# Altium schematic sheet DDR3.SchDoc (part 1 of 2)
size A3; Organization: ICNS, MARCS Institute; Address1: Werrington South Campus, Great Western Highway; Address2: Werrington, NSW, 2747; SheetNumber: 8; SheetTotal: 16
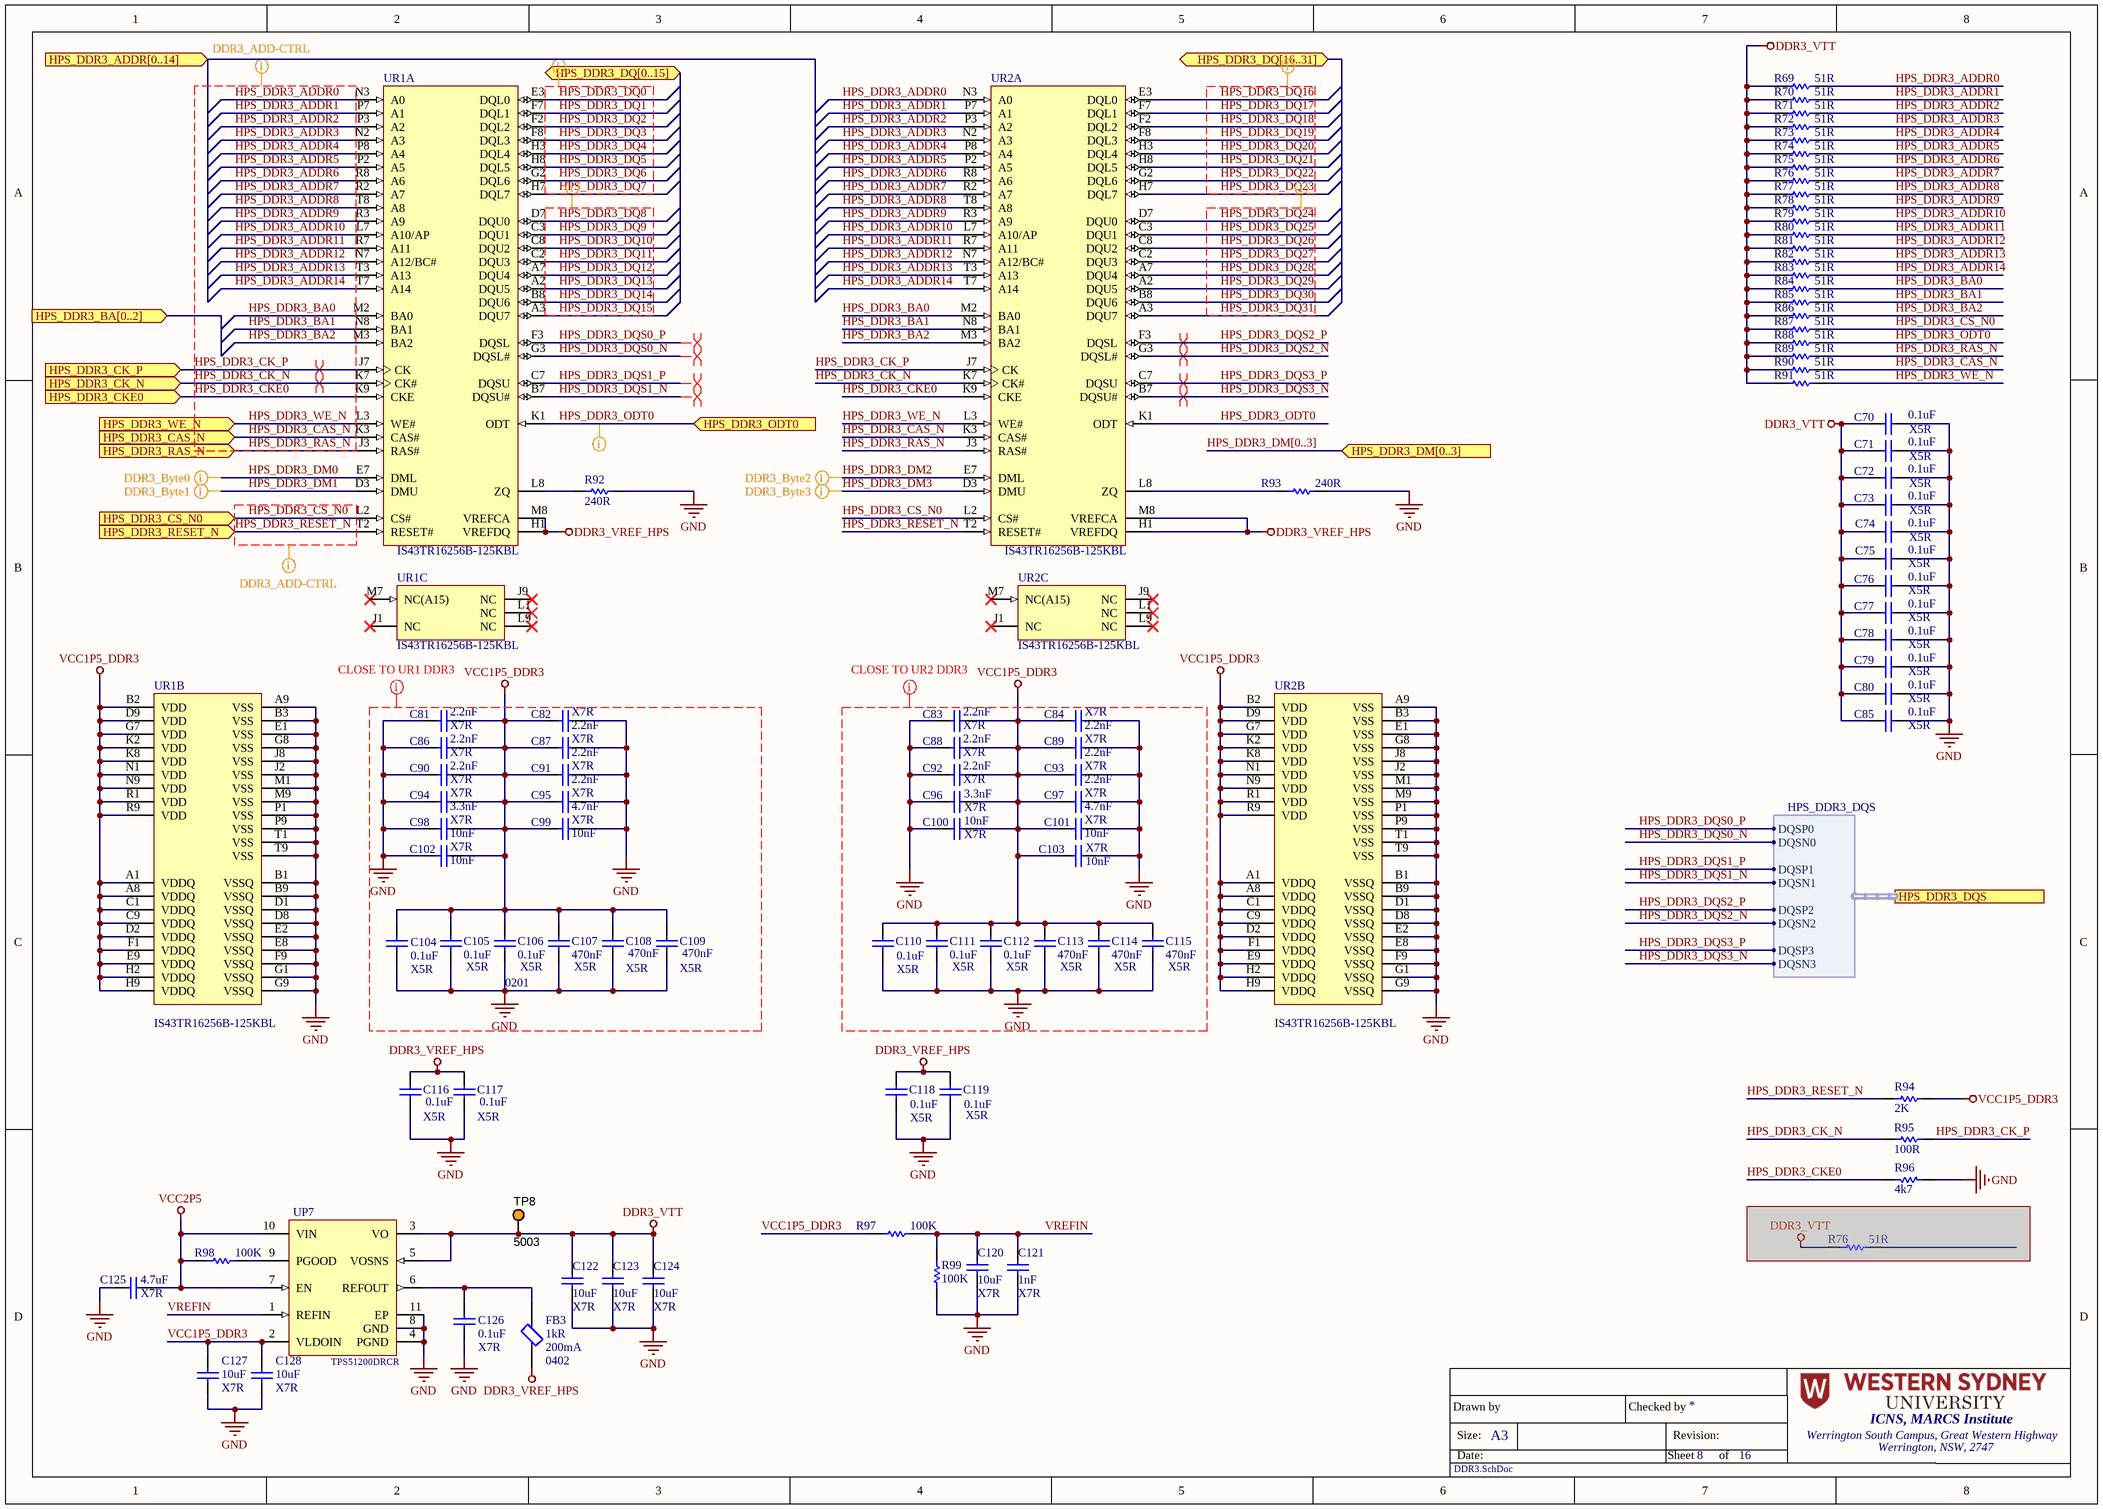
[diagram p0: DDR3.SchDoc]

## Parts
(Parts that share a designator on the sheet are numbered #1, #2 ... from top to bottom, then left to right.)
C70  value 0.1uF  Dielectric: X5R  [CAP 0201 (0603)]  (hidden comment: CL03A104KP3NNNC)
C71  value 0.1uF  Dielectric: X5R  [CAP 0201 (0603)]  (hidden comment: CL03A104KP3NNNC)
C72  value 0.1uF  Dielectric: X5R  [CAP 0201 (0603)]  (hidden comment: CL03A104KP3NNNC)
C73  value 0.1uF  Dielectric: X5R  [CAP 0201 (0603)]  (hidden comment: CL03A104KP3NNNC)
C74  value 0.1uF  Dielectric: X5R  [CAP 0201 (0603)]  (hidden comment: CL03A104KP3NNNC)
C75  value 0.1uF  Dielectric: X5R  [CAP 0201 (0603)]  (hidden comment: CL03A104KP3NNNC)
C76  value 0.1uF  Dielectric: X5R  [CAP 0201 (0603)]  (hidden comment: CL03A104KP3NNNC)
C77  value 0.1uF  Dielectric: X5R  [CAP 0201 (0603)]  (hidden comment: CL03A104KP3NNNC)
C78  value 0.1uF  Dielectric: X5R  [CAP 0201 (0603)]  (hidden comment: CL03A104KP3NNNC)
C79  value 0.1uF  Dielectric: X5R  [CAP 0201 (0603)]  (hidden comment: CL03A104KP3NNNC)
C80  value 0.1uF  Dielectric: X5R  [CAP 0201 (0603)]  (hidden comment: CL03A104KP3NNNC)
C81  Capacitance: 2.2nF  Dielectric: X7R  [CAP 0201 (0603)]  (hidden comment: CGA1A2X7R1C222K030BA)
C82  value 2.2nF  Dielectric: X7R  [CAP 0201 (0603)]  (hidden comment: CGA1A2X7R1C222K030BA)
C83  Capacitance: 2.2nF  Dielectric: X7R  [CAP 0201 (0603)]  (hidden comment: CGA1A2X7R1C222K030BA)
C84  value 2.2nF  Dielectric: X7R  [CAP 0201 (0603)]  (hidden comment: CGA1A2X7R1C222K030BA)
C85  value 0.1uF  Dielectric: X5R  [CAP 0201 (0603)]  (hidden comment: CL03A104KP3NNNC)
C86  Capacitance: 2.2nF  Dielectric: X7R  [CAP 0201 (0603)]  (hidden comment: CGA1A2X7R1C222K030BA)
C87  value 2.2nF  Dielectric: X7R  [CAP 0201 (0603)]  (hidden comment: CGA1A2X7R1C222K030BA)
C88  Capacitance: 2.2nF  Dielectric: X7R  [CAP 0201 (0603)]  (hidden comment: CGA1A2X7R1C222K030BA)
C89  value 2.2nF  Dielectric: X7R  [CAP 0201 (0603)]  (hidden comment: CGA1A2X7R1C222K030BA)
C90  value 2.2nF  Dielectric: X7R  [CAP 0201 (0603)]  (hidden comment: CGA1A2X7R1C222K030BA)
C91  value 2.2nF  Dielectric: X7R  [CAP 0201 (0603)]  (hidden comment: CGA1A2X7R1C222K030BA)
C92  value 2.2nF  Dielectric: X7R  [CAP 0201 (0603)]  (hidden comment: CGA1A2X7R1C222K030BA)
C93  value 2.2nF  Dielectric: X7R  [CAP 0201 (0603)]  (hidden comment: CGA1A2X7R1C222K030BA)
C94  value 3.3nF  Dielectric: X7R  [CAP 0201 (0603)]  (hidden comment: GRM033R71E332KA12D)
C95  value 4.7nF  Dielectric: X7R  [CAP 0201 (0603)]  (hidden comment: CC0201KRX7R5BB472)
C96  value 3.3nF  Dielectric: X7R  [CAP 0201 (0603)]  (hidden comment: GRM033R71E332KA12D)
C97  value 4.7nF  Dielectric: X7R  [CAP 0201 (0603)]  (hidden comment: CC0201KRX7R5BB472)
C98  value 10nF  Dielectric: X7R  [CAP 0201 (0603)]  (hidden comment: GRM033R71A103KA01D)
C99  value 10nF  Dielectric: X7R  [CAP 0201 (0603)]  (hidden comment: GRM033R71A103KA01D)
C100  value 10nF  Dielectric: X7R  [CAP 0201 (0603)]  (hidden comment: GRM033R71A103KA01D)
C101  value 10nF  Dielectric: X7R  [CAP 0201 (0603)]  (hidden comment: GRM033R71A103KA01D)
C102  value 10nF  Dielectric: X7R  [CAP 0201 (0603)]  (hidden comment: GRM033R71A103KA01D)
C103  value 10nF  Dielectric: X7R  [CAP 0201 (0603)]  (hidden comment: GRM033R71A103KA01D)
C104  value 0.1uF  Dielectric: X5R  [CAP 0201 (0603)]  (hidden comment: CL03A104KP3NNNC)
C105  value 0.1uF  Dielectric: X5R  [CAP 0201 (0603)]  (hidden comment: CL03A104KP3NNNC)
C106  value 0.1uF  Dielectric: X5R  Case Code (Imperial): 0201  [CAP 0201 (0603)]  (hidden comment: CL03A104KP3NNNC)
C107  value 470nF  Dielectric: X5R  [CAP 0201 (0603)]  (hidden comment: LMK063BBJ474KPLF)
C108  value 470nF  Dielectric: X5R  [CAP 0201 (0603)]  (hidden comment: LMK063BBJ474KPLF)
C109  value 470nF  Dielectric: X5R  [CAP 0201 (0603)]  (hidden comment: LMK063BBJ474KPLF)
C110  value 0.1uF  Dielectric: X5R  [CAP 0201 (0603)]  (hidden comment: CL03A104KP3NNNC)
C111  value 0.1uF  Dielectric: X5R  [CAP 0201 (0603)]  (hidden comment: CL03A104KP3NNNC)
C112  value 0.1uF  Dielectric: X5R  [CAP 0201 (0603)]  (hidden comment: CL03A104KP3NNNC)
C113  value 470nF  Dielectric: X5R  [CAP 0201 (0603)]  (hidden comment: LMK063BBJ474KPLF)
C114  value 470nF  Dielectric: X5R  [CAP 0201 (0603)]  (hidden comment: LMK063BBJ474KPLF)
C115  value 470nF  Dielectric: X5R  [CAP 0201 (0603)]  (hidden comment: LMK063BBJ474KPLF)
C116  value 0.1uF  Dielectric: X5R  [CAP 0201 (0603)]  (hidden comment: CL03A104KP3NNNC)
C117  value 0.1uF  Dielectric: X5R  [CAP 0201 (0603)]  (hidden comment: CL03A104KP3NNNC)
C118  value 0.1uF  Dielectric: X5R  [CAP 0201 (0603)]  (hidden comment: CL03A104KP3NNNC)
C119  value 0.1uF  Dielectric: X5R  [CAP 0201 (0603)]  (hidden comment: CL03A104KP3NNNC)
C120  value 10uF  Dielectric: X7R  [CAP 0805 (2012)]  (hidden comment: GCM21BR71A106KE22K)
C121  value 1nF  Dielectric: X7R  [CAP 0402 (1005)]  (hidden comment: GCM155R71H102KA37D)
C122  value 10uF  Dielectric: X7R  [CAP 0805 (2012)]  (hidden comment: GCM21BR71A106KE22K)
C123  value 10uF  Dielectric: X7R  [CAP 0805 (2012)]  (hidden comment: GCM21BR71A106KE22K)
C124  value 10uF  Dielectric: X7R  [CAP 0805 (2012)]  (hidden comment: GCM21BR71A106KE22K)
C125  value 4.7uF  Dielectric: X7R  [CAP 0805 (2012)]  (hidden comment: LMF212B7475KGHT)
C126  value 0.1uF  Dielectric: X7R  [CAP 0402 (1005)]  (hidden comment: C0402C104M8RACTU)
C127  value 10uF  Dielectric: X7R  [CAP 0805 (2012)]  (hidden comment: GCM21BR71A106KE22K)
C128  value 10uF  Dielectric: X7R  [CAP 0805 (2012)]  (hidden comment: GCM21BR71A106KE22K)
FB3  Impedance: 1kR  Case Code (Imperial): 0402  Max DC Current: 200mA  [FP-BLM15-0_05-IPC_A]  (hidden comment: BLM15AG102SN1D)
R69  Resistance: 51R  [RES 0201 (0603)]  (hidden comment: CRCW020151R0FKED)
R70  Resistance: 51R  [RES 0201 (0603)]  (hidden comment: CRCW020151R0FKED)
R71  Resistance: 51R  [RES 0201 (0603)]  (hidden comment: CRCW020151R0FKED)
R72  Resistance: 51R  [RES 0201 (0603)]  (hidden comment: CRCW020151R0FKED)
R73  Resistance: 51R  [RES 0201 (0603)]  (hidden comment: CRCW020151R0FKED)
R74  Resistance: 51R  [RES 0201 (0603)]  (hidden comment: CRCW020151R0FKED)
R75  Resistance: 51R  [RES 0201 (0603)]  (hidden comment: CRCW020151R0FKED)
R76#1  Resistance: 51R  [RES 0201 (0603)]  (hidden comment: CRCW020151R0FKED)
R76#2  Resistance: 51R  [RES 0201 (0603)]  (hidden comment: CRCW020151R0FKED)  (masked out: inside a compile mask, not in the netlist)
R77  Resistance: 51R  [RES 0201 (0603)]  (hidden comment: CRCW020151R0FKED)
R78  Resistance: 51R  [RES 0201 (0603)]  (hidden comment: CRCW020151R0FKED)
R79  Resistance: 51R  [RES 0201 (0603)]  (hidden comment: CRCW020151R0FKED)
R80  Resistance: 51R  [RES 0201 (0603)]  (hidden comment: CRCW020151R0FKED)
R81  Resistance: 51R  [RES 0201 (0603)]  (hidden comment: CRCW020151R0FKED)
R82  Resistance: 51R  [RES 0201 (0603)]  (hidden comment: CRCW020151R0FKED)
R83  Resistance: 51R  [RES 0201 (0603)]  (hidden comment: CRCW020151R0FKED)
R84  Resistance: 51R  [RES 0201 (0603)]  (hidden comment: CRCW020151R0FKED)
R85  Resistance: 51R  [RES 0201 (0603)]  (hidden comment: CRCW020151R0FKED)
R86  Resistance: 51R  [RES 0201 (0603)]  (hidden comment: CRCW020151R0FKED)
R87  Resistance: 51R  [RES 0201 (0603)]  (hidden comment: CRCW020151R0FKED)
R88  Resistance: 51R  [RES 0201 (0603)]  (hidden comment: CRCW020151R0FKED)
R89  Resistance: 51R  [RES 0201 (0603)]  (hidden comment: CRCW020151R0FKED)
R90  Resistance: 51R  [RES 0201 (0603)]  (hidden comment: CRCW020151R0FKED)
R91  Resistance: 51R  [RES 0201 (0603)]  (hidden comment: CRCW020151R0FKED)
R92  value 240R  [RES 0201 (0603)]  (hidden comment: AC0201FR-07240RL)
R93  value 240R  [RES 0201 (0603)]  (hidden comment: AC0201FR-07240RL)
R94  value 2K  [RES 0201 (0603)]  (hidden comment: CRCW02012K00FKED)
R95  value 100R  [RES 0201 (0603)]  (hidden comment: CRCW0201100RFKED)
R96  value 4k7  [RES 0201 (0603)]  (hidden comment: AC0201FR-074K7L)
R97  value 100K  [RES 0402 (1005)]  (hidden comment: CRCW0402100KFKEDHP)
R98  value 100K  [RES 0402 (1005)]  (hidden comment: CRCW0402100KFKEDHP)
R99  value 100K  [RES 0402 (1005)]  (hidden comment: CRCW0402100KFKEDHP)
TP8  5003  [KSTN-5003]
UP7  TPS51200DRCR  [DRC0010J_V]
UR1  IS43TR16256B-125KBL  [ISSI-TW-BGA-96-13000X9000DE]  (parts A,B,C of 3)
UR2  IS43TR16256B-125KBL  [ISSI-TW-BGA-96-13000X9000DE]  (parts A,B,C of 3)

## Ports
HPS_DDR3_ADDR[0..14] (in), HPS_DDR3_BA[0..2] (in), HPS_DDR3_CAS_N (in), HPS_DDR3_CK_N (in), HPS_DDR3_CK_P (in), HPS_DDR3_CKE0 (in), HPS_DDR3_CS_N0 (in), HPS_DDR3_DM[0..3] (in), HPS_DDR3_DQ[0..15] (bidir), HPS_DDR3_DQ[16..31] (bidir), HPS_DDR3_DQS (harness HPS_DDR3_DQS), HPS_DDR3_ODT0 (in), HPS_DDR3_RAS_N (in), HPS_DDR3_RESET_N (in), HPS_DDR3_WE_N (in)

## Harnesses
HPS_DDR3_DQS: DQSP0, DQSP1, DQSP2, DQSP3, DQSN0, DQSN1, DQSN2, DQSN3

## Nets
DDR3_VREF_HPS: C116.1 C117.1 C118.1 C119.1 FB3.2 UR1.H1(VREFDQ) UR1.M8(VREFCA) UR2.H1(VREFDQ) UR2.M8(VREFCA)
DDR3_VTT: C70.1 C71.1 C72.1 C73.1 C74.1 C75.1 C76.1 C77.1 C78.1 C79.1 C80.1 C85.1 C122.1 C123.1 C124.1 R69.1 R70.1 R71.1 R72.1 R73.1 R74.1 R75.1 R76#1.1 R77.1 R78.1 R79.1 R80.1 R81.1 R82.1 R83.1 R84.1 R85.1 R86.1 R87.1 R88.1 R89.1 R90.1 R91.1 TP8.1 UP7.3(VO) UP7.5(VOSNS)
GND: C70.2 C71.2 C72.2 C73.2 C74.2 C75.2 C76.2 C77.2 C78.2 C79.2 C80.2 C81.1 C82.2 C83.2 C84.2 C85.2 C86.2 C87.1 C88.2 C89.1 C90.2 C91.2 C92.2 C93.2 C94.2 C95.2 C96.1 C97.1 C98.1 C99.1 C100.2 C101.1 C102.2 C103.2 C104.2 C105.2 C106.2 C107.2 C108.2 C109.2 C110.2 C111.2 C112.2 C113.2 C114.2 C115.2 C116.2 C117.2 C118.2 C119.2 C120.2 C121.2 C122.2 C123.2 C124.2 C125.2 C126.2 C127.2 C128.2 R92.2 R93.2 R96.1 R99.1 UP7.4(PGND) UP7.8(GND) UP7.11(EP) UR1.A9(VSS) UR1.B1(VSSQ) UR1.B3(VSS) UR1.B9(VSSQ) UR1.D1(VSSQ) UR1.D8(VSSQ) UR1.E1(VSS) UR1.E2(VSSQ) UR1.E8(VSSQ) UR1.F9(VSSQ) UR1.G1(VSSQ) UR1.G8(VSS) UR1.G9(VSSQ) UR1.J2(VSS) UR1.J8(VSS) UR1.M1(VSS) UR1.M9(VSS) UR1.P1(VSS) UR1.P9(VSS) UR1.T1(VSS) UR1.T9(VSS) UR2.A9(VSS) UR2.B1(VSSQ) UR2.B3(VSS) UR2.B9(VSSQ) UR2.D1(VSSQ) UR2.D8(VSSQ) UR2.E1(VSS) UR2.E2(VSSQ) UR2.E8(VSSQ) UR2.F9(VSSQ) UR2.G1(VSSQ) UR2.G8(VSS) UR2.G9(VSSQ) UR2.J2(VSS) UR2.J8(VSS) UR2.M1(VSS) UR2.M9(VSS) UR2.P1(VSS) UR2.P9(VSS) UR2.T1(VSS) UR2.T9(VSS)
VCC1P5_DDR3: C81.2 C82.1 C83.1 C84.1 C86.1 C87.2 C88.1 C89.2 C90.1 C91.1 C92.1 C93.1 C94.1 C95.1 C96.2 C97.2 C98.2 C99.2 C100.1 C101.2 C102.1 C103.1 C104.1 C105.1 C106.1 C107.1 C108.1 C109.1 C110.1 C111.1 C112.1 C113.1 C114.1 C115.1 C127.1 C128.1 R94.1 R97.1 UP7.2(VLDOIN) UR1.A1(VDDQ) UR1.A8(VDDQ) UR1.B2(VDD) UR1.C1(VDDQ) UR1.C9(VDDQ) UR1.D2(VDDQ) UR1.D9(VDD) UR1.E9(VDDQ) UR1.F1(VDDQ) UR1.G7(VDD) UR1.H2(VDDQ) UR1.H9(VDDQ) UR1.K2(VDD) UR1.K8(VDD) UR1.N1(VDD) UR1.N9(VDD) UR1.R1(VDD) UR1.R9(VDD) UR2.A1(VDDQ) UR2.A8(VDDQ) UR2.B2(VDD) UR2.C1(VDDQ) UR2.C9(VDDQ) UR2.D2(VDDQ) UR2.D9(VDD) UR2.E9(VDDQ) UR2.F1(VDDQ) UR2.G7(VDD) UR2.H2(VDDQ) UR2.H9(VDDQ) UR2.K2(VDD) UR2.K8(VDD) UR2.N1(VDD) UR2.N9(VDD) UR2.R1(VDD) UR2.R9(VDD)
VCC2P5: C125.1 R98.1 UP7.7(EN) UP7.10(VIN)
HPS_DDR3_ADDR0: R69.2 UR1.N3(A0) UR2.N3(A0)
HPS_DDR3_ADDR1: R70.2 UR1.P7(A1) UR2.P7(A1)
HPS_DDR3_ADDR2: R71.2 UR1.P3(A2) UR2.P3(A2)
HPS_DDR3_ADDR3: R72.2 UR1.N2(A3) UR2.N2(A3)
HPS_DDR3_ADDR4: R73.2 UR1.P8(A4) UR2.P8(A4)
HPS_DDR3_ADDR5: R74.2 UR1.P2(A5) UR2.P2(A5)
HPS_DDR3_ADDR6: R75.2 UR1.R8(A6) UR2.R8(A6)
HPS_DDR3_ADDR7: R76#1.2 UR1.R2(A7) UR2.R2(A7)
HPS_DDR3_ADDR8: R77.2 UR1.T8(A8) UR2.T8(A8)
HPS_DDR3_ADDR9: R78.2 UR1.R3(A9) UR2.R3(A9)
HPS_DDR3_ADDR10: R79.2 UR1.L7(A10/AP) UR2.L7(A10/AP)
HPS_DDR3_ADDR11: R80.2 UR1.R7(A11) UR2.R7(A11)
HPS_DDR3_ADDR12: R81.2 UR1.N7(A12/BC#) UR2.N7(A12/BC#)
HPS_DDR3_ADDR13: R82.2 UR1.T3(A13) UR2.T3(A13)
HPS_DDR3_ADDR14: R83.2 UR1.T7(A14) UR2.T7(A14)
HPS_DDR3_BA0: R84.2 UR1.M2(BA0) UR2.M2(BA0)
HPS_DDR3_BA1: R85.2 UR1.N8(BA1) UR2.N8(BA1)
HPS_DDR3_BA2: R86.2 UR1.M3(BA2) UR2.M3(BA2)
HPS_DDR3_CAS_N: R90.2 UR1.K3(CAS#) UR2.K3(CAS#) ; port HPS_DDR3_CAS_N
HPS_DDR3_CK_N: R95.1 UR1.K7(CK#) UR2.K7(CK#) ; port HPS_DDR3_CK_N
HPS_DDR3_CK_P: R95.2 UR1.J7(CK) UR2.J7(CK) ; port HPS_DDR3_CK_P
HPS_DDR3_CKE0: R96.2 UR1.K9(CKE) UR2.K9(CKE) ; port HPS_DDR3_CKE0
HPS_DDR3_CS_N0: R87.2 UR1.L2(CS#) UR2.L2(CS#) ; port HPS_DDR3_CS_N0
HPS_DDR3_DM0: UR1.E7(DML)
HPS_DDR3_DM1: UR1.D3(DMU)
HPS_DDR3_DM2: UR2.E7(DML)
HPS_DDR3_DM3: UR2.D3(DMU)
HPS_DDR3_DQ0: UR1.E3(DQL0)
HPS_DDR3_DQ1: UR1.F7(DQL1)
HPS_DDR3_DQ2: UR1.F2(DQL2)
HPS_DDR3_DQ3: UR1.F8(DQL3)
HPS_DDR3_DQ4: UR1.H3(DQL4)
HPS_DDR3_DQ5: UR1.H8(DQL5)
HPS_DDR3_DQ6: UR1.G2(DQL6)
HPS_DDR3_DQ7: UR1.H7(DQL7)
HPS_DDR3_DQ8: UR1.D7(DQU0)
HPS_DDR3_DQ9: UR1.C3(DQU1)
HPS_DDR3_DQ10: UR1.C8(DQU2)
HPS_DDR3_DQ11: UR1.C2(DQU3)
HPS_DDR3_DQ12: UR1.A7(DQU4)
HPS_DDR3_DQ13: UR1.A2(DQU5)
HPS_DDR3_DQ14: UR1.B8(DQU6)
HPS_DDR3_DQ15: UR1.A3(DQU7)
HPS_DDR3_DQ16: UR2.E3(DQL0)
HPS_DDR3_DQ17: UR2.F7(DQL1)
HPS_DDR3_DQ18: UR2.F2(DQL2)
HPS_DDR3_DQ19: UR2.F8(DQL3)
HPS_DDR3_DQ20: UR2.H3(DQL4)
HPS_DDR3_DQ21: UR2.H8(DQL5)
HPS_DDR3_DQ22: UR2.G2(DQL6)
HPS_DDR3_DQ23: UR2.H7(DQL7)
HPS_DDR3_DQ24: UR2.D7(DQU0)
HPS_DDR3_DQ25: UR2.C3(DQU1)
HPS_DDR3_DQ26: UR2.C8(DQU2)
HPS_DDR3_DQ27: UR2.C2(DQU3)
HPS_DDR3_DQ28: UR2.A7(DQU4)
HPS_DDR3_DQ29: UR2.A2(DQU5)
HPS_DDR3_DQ30: UR2.B8(DQU6)
HPS_DDR3_DQ31: UR2.A3(DQU7)
HPS_DDR3_DQS0_N: UR1.G3(DQSL#) ; port HPS_DDR3_DQS.DQSN0
HPS_DDR3_DQS0_P: UR1.F3(DQSL) ; port HPS_DDR3_DQS.DQSP0
HPS_DDR3_DQS1_N: UR1.B7(DQSU#) ; port HPS_DDR3_DQS.DQSN1
HPS_DDR3_DQS1_P: UR1.C7(DQSU) ; port HPS_DDR3_DQS.DQSP1
HPS_DDR3_DQS2_N: UR2.G3(DQSL#) ; port HPS_DDR3_DQS.DQSN2
HPS_DDR3_DQS2_P: UR2.F3(DQSL) ; port HPS_DDR3_DQS.DQSP2
HPS_DDR3_DQS3_N: UR2.B7(DQSU#) ; port HPS_DDR3_DQS.DQSN3
HPS_DDR3_DQS3_P: UR2.C7(DQSU) ; port HPS_DDR3_DQS.DQSP3
HPS_DDR3_ODT0: R88.2 UR1.K1(ODT) UR2.K1(ODT) ; port HPS_DDR3_ODT0
HPS_DDR3_RAS_N: R89.2 UR1.J3(RAS#) UR2.J3(RAS#) ; port HPS_DDR3_RAS_N
HPS_DDR3_RESET_N: R94.2 UR1.T2(RESET#) UR2.T2(RESET#) ; port HPS_DDR3_RESET_N
HPS_DDR3_WE_N: R91.2 UR1.L3(WE#) UR2.L3(WE#) ; port HPS_DDR3_WE_N
VREFIN: C120.1 C121.1 R97.2 R99.2 UP7.1(REFIN)
NetC126_1: C126.1 FB3.1 UP7.6(REFOUT)
NetR92_1: R92.1 UR1.L8(ZQ)
NetR93_1: R93.1 UR2.L8(ZQ)
NetR98_2: R98.2 UP7.9(PGOOD)

Not connected (* = marked no-connect by the designer): UR1 J1(NC)* J9(NC)* L1(NC)* L9(NC)* M7(NC(A15))*; UR2 J1(NC)* J9(NC)* L1(NC)* L9(NC)* M7(NC(A15))*

## Buses and harness runs
bus HPS_DDR3_DM[0..3] = port HPS_DDR3_DM[0..3]

## Layout directives
mark named CLOSE TO UR2 DDR3: GND
mark named CLOSE TO UR1 DDR3: GND
differential pair; differential pair class HPS_DDR3_CK: HPS_DDR3_CK_N, HPS_DDR3_CK_P
differential pair; differential pair class HPS_DDR3_DQS0; net class DDR3_B0: HPS_DDR3_DQS0_N, HPS_DDR3_DQS0_P
differential pair; differential pair class HPS_DDR3_DQS1; net class DDR3_B1: HPS_DDR3_DQS1_N, HPS_DDR3_DQS1_P
differential pair; differential pair class HPS_DDR3_DQS2; net class DDR3_B2: HPS_DDR3_DQS2_N, HPS_DDR3_DQS2_P
differential pair; differential pair class HPS_DDR3_DQS3; net class DDR3_B3: HPS_DDR3_DQS3_N, HPS_DDR3_DQS3_P
net class DDR3_B2: HPS_DDR3_DM2, HPS_DDR3_DQ16, HPS_DDR3_DQ17, HPS_DDR3_DQ18, HPS_DDR3_DQ19, HPS_DDR3_DQ20, HPS_DDR3_DQ21, HPS_DDR3_DQ22, HPS_DDR3_DQ23
net class DDR3_B3: HPS_DDR3_DM3, HPS_DDR3_DQ24, HPS_DDR3_DQ25, HPS_DDR3_DQ26, HPS_DDR3_DQ27, HPS_DDR3_DQ28, HPS_DDR3_DQ29, HPS_DDR3_DQ30, HPS_DDR3_DQ31
net class DDR3_B0: HPS_DDR3_DM0, HPS_DDR3_DQ0, HPS_DDR3_DQ1, HPS_DDR3_DQ2, HPS_DDR3_DQ3, HPS_DDR3_DQ4, HPS_DDR3_DQ5, HPS_DDR3_DQ6, HPS_DDR3_DQ7
net class DDR3_B1: HPS_DDR3_DM1, HPS_DDR3_DQ8, HPS_DDR3_DQ9, HPS_DDR3_DQ10, HPS_DDR3_DQ11, HPS_DDR3_DQ12, HPS_DDR3_DQ13, HPS_DDR3_DQ14, HPS_DDR3_DQ15
net class DDR3_ADD-CTRL: HPS_DDR3_ADDR0, HPS_DDR3_ADDR1, HPS_DDR3_ADDR2, HPS_DDR3_ADDR3, HPS_DDR3_ADDR4, HPS_DDR3_ADDR5, HPS_DDR3_ADDR6, HPS_DDR3_ADDR7, HPS_DDR3_ADDR8, HPS_DDR3_ADDR9, HPS_DDR3_ADDR10, HPS_DDR3_ADDR11, HPS_DDR3_ADDR12, HPS_DDR3_ADDR13, HPS_DDR3_ADDR14, HPS_DDR3_BA0, HPS_DDR3_BA1, HPS_DDR3_BA2, HPS_DDR3_CAS_N, HPS_DDR3_CK_N, HPS_DDR3_CK_P, HPS_DDR3_CKE0, HPS_DDR3_CS_N0, HPS_DDR3_ODT0, HPS_DDR3_RAS_N, HPS_DDR3_RESET_N, HPS_DDR3_WE_N

## Notes on the sheet
- Drawn by
- Size:
- Date:
- A3
- Checked by
- Sheet
- Revision:
- of